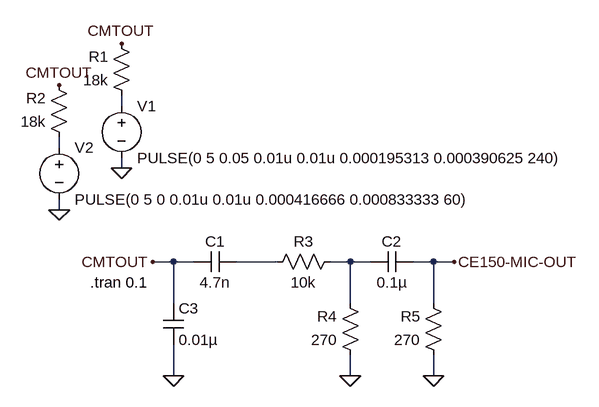
[diagram p0: schematic ce150-mic-out.asc]
ce150-mic-out.asc, the LTspice schematic file:
Version 4
SHEET 1 1840 680
WIRE 32 -416 32 -432
WIRE -64 -352 -64 -368
WIRE 32 -320 32 -336
WIRE -64 -256 -64 -272
WIRE 112 -176 80 -176
WIRE 144 -176 112 -176
WIRE 272 -176 208 -176
WIRE 384 -176 352 -176
WIRE 416 -176 384 -176
WIRE 512 -176 480 -176
WIRE 544 -176 512 -176
WIRE 112 -112 112 -176
WIRE 384 -112 384 -176
WIRE 512 -112 512 -176
WIRE 112 0 112 -48
WIRE 384 0 384 -32
WIRE 512 0 512 -32
FLAG 32 -320 0
FLAG 384 0 0
FLAG 512 0 0
FLAG 112 0 0
FLAG -64 -256 0
FLAG 544 -176 CE150-MIC-OUT
FLAG 80 -176 CMTOUT
FLAG 32 -512 CMTOUT
FLAG -64 -448 CMTOUT
SYMBOL voltage 32 -432 R0
WINDOW 123 0 0 Left 2
WINDOW 39 0 0 Left 2
SYMATTR InstName V1
SYMATTR Value PULSE(0 5 0.05 0.01u 0.01u 0.000195313 0.000390625 240)
SYMBOL res 48 -416 R180
WINDOW 0 36 76 Left 2
WINDOW 3 36 40 Left 2
SYMATTR InstName R1
SYMATTR Value 18k
SYMBOL res 368 -192 R90
WINDOW 0 0 56 VBottom 2
WINDOW 3 32 56 VTop 2
SYMATTR InstName R3
SYMATTR Value 10k
SYMBOL res 400 -16 R180
WINDOW 0 36 76 Left 2
WINDOW 3 36 40 Left 2
SYMATTR InstName R4
SYMATTR Value 270
SYMBOL res 528 -16 R180
WINDOW 0 36 76 Left 2
WINDOW 3 36 40 Left 2
SYMATTR InstName R5
SYMATTR Value 270
SYMBOL cap 208 -192 R90
WINDOW 0 0 32 VBottom 2
WINDOW 3 32 32 VTop 2
SYMATTR InstName C1
SYMATTR Value 4.7n
SYMBOL cap 480 -192 R90
WINDOW 0 0 32 VBottom 2
WINDOW 3 32 32 VTop 2
SYMATTR InstName C2
SYMATTR Value 0.1µ
SYMBOL cap 96 -112 R0
SYMATTR InstName C3
SYMATTR Value 0.01µ
SYMBOL voltage -64 -368 R0
WINDOW 123 0 0 Left 2
WINDOW 39 0 0 Left 2
SYMATTR InstName V2
SYMATTR Value PULSE(0 5 0 0.01u 0.01u 0.000416666 0.000833333 60)
SYMBOL res -48 -352 R180
WINDOW 0 36 76 Left 2
WINDOW 3 36 40 Left 2
SYMATTR InstName R2
SYMATTR Value 18k
TEXT -16 -144 Left 2 !.tran 0.1

The netlist it stands for:
* ce150-mic-out.asc
V1 N001 0 PULSE(0 5 0.05 0.01u 0.01u 0.000195313 0.000390625 240)
R1 N001 CMTOUT 18k
R3 N004 N003 10k
R4 0 N004 270
R5 0 CE150-MIC-OUT 270
C1 N003 CMTOUT 4.7n
C2 CE150-MIC-OUT N004 0.1µ
C3 CMTOUT 0 0.01µ
V2 N002 0 PULSE(0 5 0 0.01u 0.01u 0.000416666 0.000833333 60)
R2 N002 CMTOUT 18k
.tran 0.1
.backanno
.end